# Altium schematic sheet Motor control logic.SchDoc
size 381 x 254 mm; SheetNumber: 7; SheetTotal: 7
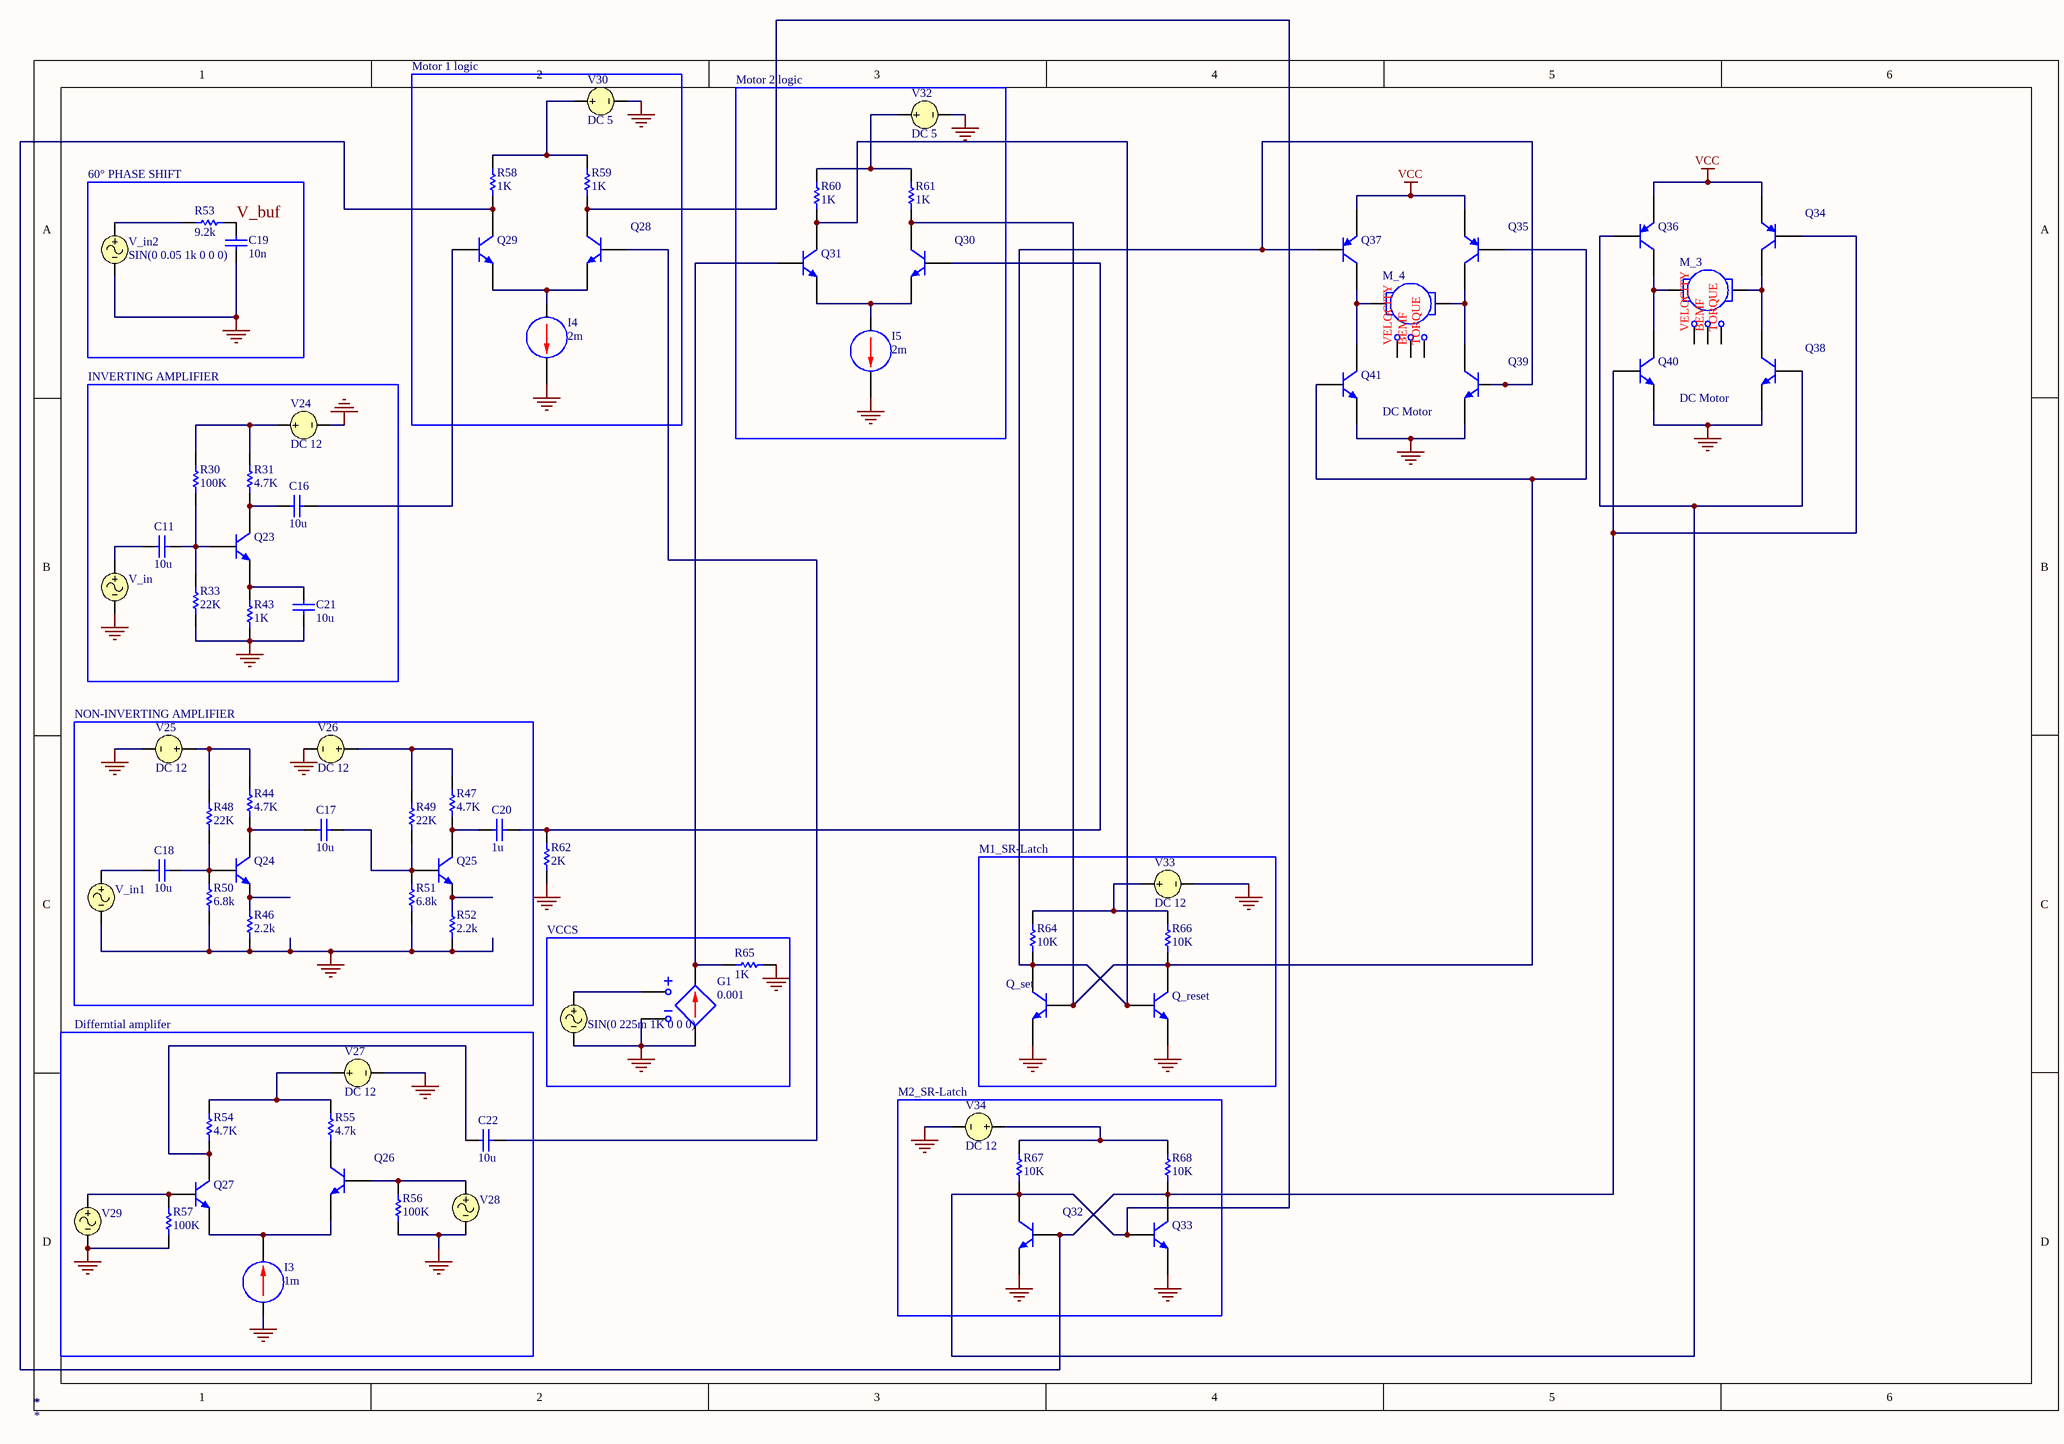
[diagram p0: Motor control logic.SchDoc]

## Parts
(Parts that share a designator on the sheet are numbered #1, #2 ... from top to bottom, then left to right.)
*#1  *
*#2  *
C11  value 10u  (hidden comment: Capacitor)
C16  value 10u  (hidden comment: Capacitor)
C17  value 10u  (hidden comment: Capacitor)
C18  value 10u  (hidden comment: Capacitor)
C19  value 10n  (hidden comment: Capacitor)
C20  value 1u  (hidden comment: Capacitor)
C21  value 10u  (hidden comment: Capacitor)
C22  value 10u  (hidden comment: Capacitor)
G1  Gain: 0.001  (hidden comment: Voltage Controlled Current Source)
I3  DC: 1m  (hidden comment: DC Current Source)
I4  DC: 2m  (hidden comment: DC Current Source)
I5  DC: 2m  (hidden comment: DC Current Source)
M_3  DC Motor
M_4  DC Motor
Q23  Bipolar NPN 3 Pins Transistor VBIC Model  (value not drawn)
Q24  Bipolar NPN 3 Pins Transistor Modified Version of the Gummel-Poon Model  (value not drawn)
Q25  Bipolar NPN 3 Pins Transistor Modified Version of the Gummel-Poon Model  (value not drawn)
Q26  Bipolar NPN 3 Pins Transistor VBIC Model  (value not drawn)
Q27  Bipolar NPN 3 Pins Transistor VBIC Model  (value not drawn)
Q28  Bipolar NPN 3 Pins Transistor Modified Version of the Gummel-Poon Model  (value not drawn)
Q29  Bipolar NPN 3 Pins Transistor Modified Version of the Gummel-Poon Model  (value not drawn)
Q30  Bipolar NPN 3 Pins Transistor Modified Version of the Gummel-Poon Model  (value not drawn)
Q31  Bipolar NPN 3 Pins Transistor Modified Version of the Gummel-Poon Model  (value not drawn)
Q32  Bipolar NPN 3 Pins Transistor VBIC Model  (value not drawn)
Q33  Bipolar NPN 3 Pins Transistor VBIC Model  (value not drawn)
Q34  Bipolar PNP 3 Pins Transistor Gummel-Poon Model  (value not drawn)
Q35  Bipolar PNP 3 Pins Transistor Gummel-Poon Model  (value not drawn)
Q36  Bipolar PNP 3 Pins Transistor Gummel-Poon Model  (value not drawn)
Q37  Bipolar PNP 3 Pins Transistor Gummel-Poon Model  (value not drawn)
Q38  Bipolar NPN 3 Pins Transistor VBIC Model  (value not drawn)
Q39  Bipolar NPN 3 Pins Transistor VBIC Model  (value not drawn)
Q40  Bipolar NPN 3 Pins Transistor VBIC Model  (value not drawn)
Q41  Bipolar NPN 3 Pins Transistor VBIC Model  (value not drawn)
Q_reset  Bipolar NPN 3 Pins Transistor VBIC Model  (value not drawn)
Q_set  Bipolar NPN 3 Pins Transistor VBIC Model  (value not drawn)
R30  value 100K  (hidden comment: Resistor)
R31  value 4.7K  (hidden comment: Resistor)
R33  value 22K  (hidden comment: Resistor)
R43  value 1K  (hidden comment: Resistor)
R44  value 4.7K  (hidden comment: Resistor)
R46  value 2.2k  (hidden comment: Resistor)
R47  value 4.7K  (hidden comment: Resistor)
R48  value 22K  (hidden comment: Resistor)
R49  value 22K  (hidden comment: Resistor)
R50  value 6.8k  (hidden comment: Resistor)
R51  value 6.8k  (hidden comment: Resistor)
R52  value 2.2k  (hidden comment: Resistor)
R53  value 9.2k  (hidden comment: Resistor)
R54  value 4.7K  (hidden comment: Resistor)
R55  value 4.7k  (hidden comment: Resistor)
R56  value 100K  (hidden comment: Resistor)
R57  value 100K  (hidden comment: Resistor)
R58  value 1K  (hidden comment: Resistor)
R59  value 1K  (hidden comment: Resistor)
R60  value 1K  (hidden comment: Resistor)
R61  value 1K  (hidden comment: Resistor)
R62  value 2K  (hidden comment: Resistor)
R64  value 10K  (hidden comment: Resistor)
R65  value 1K  (hidden comment: Resistor)
R66  value 10K  (hidden comment: Resistor)
R67  value 10K  (hidden comment: Resistor)
R68  value 10K  (hidden comment: Resistor)
V24  DC 12
V25  DC 12
V26  DC 12
V27  DC 12
V28  SIN(0 50m 1K 0 0 60)  (value not drawn)
V29  SIN(0 50m 1K 0 0 0)  (value not drawn)
V30  DC 5
V31  SIN(0 225m 1K 0 0 0)
V32  DC 5
V33  DC 12
V34  DC 12
V_in  SIN(0 0.1 1K 0 0 0)  (value not drawn)
V_in1  SIN(0 0.1 1K 0 0 0)  (value not drawn)
V_in2  SIN(0 0.05 1k 0 0 0)

## Blocks framed on the sheet
Motor 1 logic: I4 Q28 Q29 R58 R59 V30
Motor 2 logic: I5 Q30 Q31 R60 R61 V32
60° PHASE SHIFT: C19 R53 V_in2
INVERTING AMPLIFIER: *#1 C11 C16 C21 Q23 R30 R31 R33 R43 V24 V_in
NON-INVERTING AMPLIFIER: C17 C18 C20 Q24 Q25 R44 R46-R52 V25 V26 V_in1
M1_SR-Latch: Q_reset Q_set R64 R66 V33
VCCS: *#2 G1 R65 V31
Differntial amplifer: C22 I3 Q26 Q27 R54-R57 V27-V29
M2_SR-Latch: Q32 Q33 R67 R68 V34

## Nets
GND: C19.1 C21.1 G1.2 G1.4 I3.2(-) I4.1(+) I5.1(+) Q32.3(E) Q33.3(E) Q38.3(E) Q39.3(E) Q40.3(E) Q41.3(E) Q_reset.3(E) Q_set.3(E) R33.1 R43.1 R46.1 R50.1 R51.1 R52.1 R56.1 R57.1 R62.1 R65.2 V24.2 V25.2 V26.2 V27.2 V28.2 V29.2 V30.2 V31.2 V32.2 V33.2 V34.2 V_in.2 V_in1.2 V_in2.2
VCC: Q34.3(E) Q35.3(E) Q36.3(E) Q37.3(E)
V_buf: C19.2 R53.2
NetC11_1: C11.1 V_in.1
NetC11_2: C11.2 Q23.2(B) R30.1 R33.2
NetC16_1: C16.1 Q23.1(C) R31.1
NetC16_2: C16.2 Q29.2(B)
NetC17_1: C17.1 Q24.1(C) R44.1
NetC17_2: C17.2 Q25.2(B) R49.1 R51.2
NetC18_1: C18.1 V_in1.1
NetC18_2: C18.2 Q24.2(B) R48.1 R50.2
NetC20_1: C20.1 Q25.1(C) R47.1
NetC20_2: C20.2 Q30.2(B) R62.2
NetC21_2: C21.2 Q23.3(E) R43.2
NetC22_1: C22.1 Q27.1(C) R54.1
NetC22_2: C22.2 Q28.2(B)
NetG1_1: G1.1 Q31.2(B) R65.1
NetG1_3: G1.3 V31.1
NetI3_1: I3.1(+) Q26.3(E) Q27.3(E)
NetI4_2: I4.2(-) Q28.3(E) Q29.3(E)
NetI5_2: I5.2(-) Q30.3(E) Q31.3(E)
NetM_3_1: M_3.1 Q36.1(C) Q40.1(C)
NetM_3_2: M_3.2 Q34.1(C) Q38.1(C)
NetM_4_1: M_4.1 Q37.1(C) Q41.1(C)
NetM_4_2: M_4.2 Q35.1(C) Q39.1(C)
NetQ24_3: Q24.3(E) R46.2
NetQ25_3: Q25.3(E) R52.2
NetQ26_2: Q26.2(B) R56.2 V28.1
NetQ27_2: Q27.2(B) R57.2 V29.1
NetQ28_1: Q28.1(C) Q32.1(C) Q33.2(B) Q36.2(B) Q38.2(B) R59.1 R67.1
NetQ29_1: Q29.1(C) Q32.2(B) Q33.1(C) Q34.2(B) Q40.2(B) R58.1 R68.1
NetQ30_1: Q30.1(C) Q35.2(B) Q41.2(B) Q_reset.1(C) Q_set.2(B) R61.1 R66.1
NetQ31_1: Q31.1(C) Q37.2(B) Q39.2(B) Q_reset.2(B) Q_set.1(C) R60.1 R64.1
NetR30_2: R30.2 R31.2 V24.1
NetR44_2: R44.2 R48.2 V25.1
NetR47_2: R47.2 R49.2 V26.1
NetR53_1: R53.1 V_in2.1
NetR54_2: R54.2 R55.2 V27.1
NetR58_2: R58.2 R59.2 V30.1
NetR60_2: R60.2 R61.2 V32.1
NetR64_2: R64.2 R66.2 V33.1
NetR67_2: R67.2 R68.2 V34.1

Not connected (* = marked no-connect by the designer): M_3 3 4 5; M_4 3 4 5; Q26 1(C); R55 1

## Notes on the sheet
- (in symbol DC Motor) VELOCITY; BEMF; TORQUE

## Library data of the parts
*#1 *#2 = VSIN: Sinusoidal Voltage Source
C11 C16-C22 = Capacitor: SimulationGenericComponent: True
G1 = VCCS: SimulationGenericComponent: True
I3-I5 = DC Current Source: SimulationGenericComponent: True
M_3 M_4 = DC Motor: LA: 1.5M; RA: 0.5; KE: 0.05; JM: 250U; BM: 0.1M; TL: 0; SimulationGenericComponent: True; KT: 0.05
Q23 Q26 Q27 Q32 Q33 Q38-Q41 Q_reset Q_set = BJT NPN VBIC: SimulationGenericComponent: True; AFN: 1; AJC: -0.5; ART: 0.1; AVC1: 0; EA: 1.12; FC: 0.9; IBBE: 1e-06; IBCI: 1e-16; IBEI: 1e-18; MC: 0.33; NCN: 2; NKF: 0.5; PC: 0.75; TNOM: 27; VERS: 1.2; XII: 3; AJE: -0.5; AJS: -0.5; AVC2: 0; BFN: 1; CBCO: 0; CBEO: 0; CCSO: 0; CJC: 0; CJCP: 0; CJE: 0; CJEP: 0; CTH: 0; DEAR: 0; EAIC: 1.12; EAIE: 1.12; EAIS: 1.12; EANC: 1.12; EANE: 1.12; EANS: 1.12; EAP: 1.12; EBBE: 0; GAMM: 0; HRCF: 1; IBCIP: 0; IBCN: 0; IBCNP: 0; IBEIP: 0; IBEN: 0; IBENP: 0; IKF: 0; IKP: 0; IKR: 0; IS: 1e-16; ISP: 0; ISRR: 1; ITF: 0; KFN: 0; ME: 0.33; MS: 0.33; NBBE: 1; NCI: 1; NCIP: 1; NCNP: 2; NEI: 1; NEN: 2; NF: 1; NFP: 1; NR: 1; PE: 0.75; PS: 0.75; QBM: 0; QCO: 0; QTF: 0; RBI: 0.1; RBP: 0.1; RBX: 0; RCI: 0.1; RCX: 0; RE: 0; RS: 0; RTH: 0; TAVC: 0; TD: 0; TF: 0; TNBBE: 0; TNF: 0; TR: 0; TVBBE1: 0; TVBBE2: 0; VBBE: 0; VEF: 0; VER: 0; VO: 0; VREF: 0; VRT: 0; VTF: 0; WBE: 1; WSP: 1; XIKF: 0; XIN: 3; XIS: 3; XISR: 0; XRBI: 0; XRBP: 0; XRBX: 0; XRCI: 0; XRCX: 0; XRE: 0; XRS: 0; XTF: 0; XVO: 0
Q24 Q25 Q28-Q31 = BJT NPN_MGP: BF: 100; AF: 0; BR: 1; EG: 1.11; FC: 0.5; IS: 1e-16; MJC: 0.33; NC: 2; NE: 1.5; TNOM: 27; VBC_MAX: 1e99; VJC: 0.75; XTI: 3; SimulationGenericComponent: True; CJC: 0; CJE: 0; CJS: 0; CTC: 0; CTE: 0; CTS: 0; IKF: 0; IKR: 0; IRB: 0; ISC: 0; ISE: 0; ISS: 0; ITF: 0; KF: 0; MJE: 0.33; MJS: 0; NF: 1; NKF: 0.5; NR: 1; NS: 1; PTF: 0; RB: 0; RBM: 0; RC: 0; RE: 0; SUBS: 1; TBF1: 0; TBF2: 0; TBR1: 0; TBR2: 0; TF: 0; TIKF1: 0; TIKF2: 0; TIKR1: 0; TIKR2: 0; TIRB1: 0; TIRB2: 0; TIS1: 0; TIS2: 0; TISC1: 0; TISC2: 0; TISE1: 0; TISE2: 0; TITF1: 0; TITF2: 0; TLEV: 0; TLEVC: 0; TMJC1: 0; TMJC2: 0; TMJE1: 0; TMJE2: 0; TMJS1: 0; TMJS2: 0; TNC1: 0; TNC2: 0; TNE1: 0; TNE2: 0; TNF1: 0; TNF2: 0; TNR1: 0; TNR2: 0; TNS1: 0; TNS2: 0; TR: 0; TRB1: 0; TRB2: 0; TRC1: 0; TRC2: 0; TRE1: 0; TRE2: 0; TRM1: 0; TRM2: 0; TTF1: 0; TTF2: 0; TTR1: 0; TTR2: 0; TVAF1: 0; TVAF2: 0; TVAR1: 0; TVAR2: 0; TVJC: 0; TVJE: 0; TVJS: 0; VAF: 0; VAR: 0; VBE_MAX: 1e99; VCE_MAX: 1e99; VJE: 0.75; VJS: 0.75; VTF: 0; XCJC: 1; XTB: 0; XTF: 0
Q34-Q37 = BJT PNP GP: BF: 100; AF: 0; BR: 1; EG: 1.11; FC: 0.5; IS: 1e-16; MJC: 0.33; NC: 2; NE: 1.5; TNOM: 27; VBC_MAX: 1e99; VJC: 0.75; XTI: 3; SimulationGenericComponent: True; CJC: 0; CJE: 0; CJS: 0; CTC: 0; CTE: 0; CTS: 0; IKF: 0; IKR: 0; IRB: 0; ISC: 0; ISE: 0; ISS: 0; ITF: 0; KF: 0; MJE: 0.33; MJS: 0; NF: 1; NKF: 0.5; NR: 1; NS: 1; PTF: 0; RB: 0; RBM: 0; RC: 0; RE: 0; SUBS: 1; TBF1: 0; TBF2: 0; TBR1: 0; TBR2: 0; TF: 0; TIKF1: 0; TIKF2: 0; TIKR1: 0; TIKR2: 0; TIRB1: 0; TIRB2: 0; TIS1: 0; TIS2: 0; TISC1: 0; TISC2: 0; TISE1: 0; TISE2: 0; TITF1: 0; TITF2: 0; TLEV: 0; TLEVC: 0; TMJC1: 0; TMJC2: 0; TMJE1: 0; TMJE2: 0; TMJS1: 0; TMJS2: 0; TNC1: 0; TNC2: 0; TNE1: 0; TNE2: 0; TNF1: 0; TNF2: 0; TNR1: 0; TNR2: 0; TNS1: 0; TNS2: 0; TR: 0; TRB1: 0; TRB2: 0; TRC1: 0; TRC2: 0; TRE1: 0; TRE2: 0; TRM1: 0; TRM2: 0; TTF1: 0; TTF2: 0; TTR1: 0; TTR2: 0; TVAF1: 0; TVAF2: 0; TVAR1: 0; TVAR2: 0; TVJC: 0; TVJE: 0; TVJS: 0; VAF: 0; VAR: 0; VBE_MAX: 1e99; VCE_MAX: 1e99; VJE: 0.75; VJS: 0.75; VTF: 0; XCJC: 1; XTB: 0; XTF: 0
R30 R31 R33 R43 R44 R46-R62 R64-R68 = Resistor: TC1: 0; SimulationGenericComponent: True; TC2: 0
V24-V27 V33 V34 = VSRC: Voltage Source; Note: PCB Footprint - Not required; AC Magnitude: 1; AC Phase: 0; Value: 12; Published: 8-Jun-2000; LatestRevisionDate: 17-Jul-2002; LatestRevisionNote: Re-released for DXP Platform.; PackageReference: Not Applicable; Publisher: Altium Limited
V28 = VSIN: Sinusoidal Voltage Source; Note: PCB Footprint - Not required; Offset: 0; Phase: 60; DC Magnitude: 2; AC Magnitude: 1; Published: 8-Jun-2000; LatestRevisionDate: 15-Nov-2004; LatestRevisionNote: Corrected Netlist.; PackageReference: Not Applicable; Publisher: Altium Limited; Amplitude: 50m; Frequency: 1K; Delay: 0; Damping Factor: 0; AC Phase: 0
V29 = VSIN: Sinusoidal Voltage Source; Note: PCB Footprint - Not required; Offset: 0; DC Magnitude: 2; AC Magnitude: 1; Published: 8-Jun-2000; LatestRevisionDate: 15-Nov-2004; LatestRevisionNote: Corrected Netlist.; PackageReference: Not Applicable; Publisher: Altium Limited; Amplitude: 50m; Frequency: 1K; Delay: 0; Damping Factor: 0; Phase: 0; AC Phase: 0
V30 V32 = VSRC: Voltage Source; Note: PCB Footprint - Not required; AC Magnitude: 1; AC Phase: 0; Value: 5; Published: 8-Jun-2000; LatestRevisionDate: 17-Jul-2002; LatestRevisionNote: Re-released for DXP Platform.; PackageReference: Not Applicable; Publisher: Altium Limited
V31 = VSIN: Sinusoidal Voltage Source; Note: PCB Footprint - Not required; Offset: 0; Published: 8-Jun-2000; LatestRevisionDate: 15-Nov-2004; LatestRevisionNote: Corrected Netlist.; PackageReference: Not Applicable; Publisher: Altium Limited; Amplitude: 225m; Frequency: 1K; Delay: 0; Damping Factor: 0; Phase: 0; DC Magnitude: 0; AC Magnitude: 225m; AC Phase: 0
V_in V_in1 = VSIN: Sinusoidal Voltage Source; Note: PCB Footprint - Not required; Offset: 0; Amplitude: 0.1; AC Magnitude: 1; Published: 8-Jun-2000; LatestRevisionDate: 15-Nov-2004; LatestRevisionNote: Corrected Netlist.; PackageReference: Not Applicable; Publisher: Altium Limited; Frequency: 1K; Delay: 0; Damping Factor: 0; Phase: 0; DC Magnitude: 0; AC Phase: 0
V_in2 = VSIN: Sinusoidal Voltage Source; Note: PCB Footprint - Not required; Offset: 0; Amplitude: 0.05; AC Magnitude: 1; Published: 8-Jun-2000; LatestRevisionDate: 15-Nov-2004; LatestRevisionNote: Corrected Netlist.; PackageReference: Not Applicable; Publisher: Altium Limited; Frequency: 1k; Delay: 0; Damping Factor: 0; Phase: 0; DC Magnitude: 0; AC Phase: 0